# Altium schematic sheet Soil.SchDoc
size A
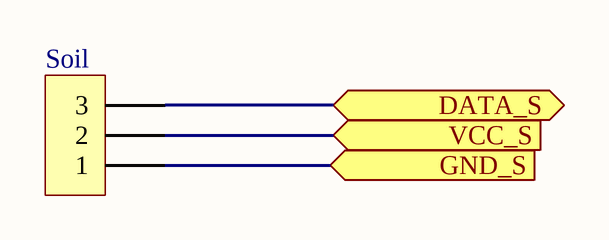
[diagram p0: Soil.SchDoc]

## Parts
Soil  Header 3P 2.54 Duc Thang  [XH2.54M-3]  (value not drawn)

## Ports
DATA_S (bidir), GND_S (in), VCC_S (in)

## Nets
DATA_S: Soil.3 ; port DATA_S
GND_S: Soil.1 ; port GND_S
VCC_S: Soil.2 ; port VCC_S

## Library data of the parts
Soil = Header 3P 2.54 Duc Thang: Cắm; Ten_Linh_Kien: Header 3P XH2.54-3P Đực Thẳng; Don_Vi: Con; Ma_Hang: MH001292; Chung_Loai: Cắm